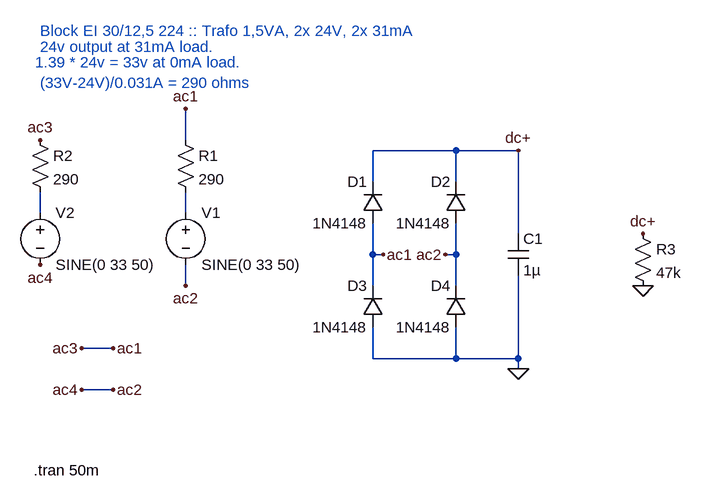
[diagram p0: schematic powersupply_ltspice_simulation.asc]
powersupply_ltspice_simulation.asc, the LTspice schematic file:
Version 4
SHEET 1 932 680
WIRE 160 96 160 48
WIRE 576 112 448 112
WIRE 672 112 576 112
WIRE 448 160 448 112
WIRE 576 160 576 112
WIRE -64 208 -64 176
WIRE 160 208 160 176
WIRE 672 240 672 112
WIRE 448 272 448 224
WIRE 464 272 448 272
WIRE 576 272 576 224
WIRE 576 272 560 272
WIRE 160 320 160 288
WIRE 448 320 448 272
WIRE 576 320 576 272
WIRE 48 416 0 416
WIRE 448 432 448 384
WIRE 576 432 576 384
WIRE 576 432 448 432
WIRE 672 432 672 304
WIRE 672 432 576 432
WIRE 672 448 672 432
WIRE 48 480 0 480
FLAG 160 48 ac1
FLAG -64 288 ac4
FLAG 160 320 ac2
FLAG 464 272 ac1
FLAG 560 272 ac2
FLAG 672 448 0
FLAG 672 112 dc+
FLAG 864 240 dc+
FLAG 864 320 0
FLAG -64 96 ac3
FLAG 0 416 ac3
FLAG 48 416 ac1
FLAG 0 480 ac4
FLAG 48 480 ac2
SYMBOL voltage 160 192 R0
WINDOW 123 0 0 Left 2
WINDOW 39 0 0 Left 2
SYMATTR InstName V1
SYMATTR Value SINE(0 33 50)
SYMBOL res 144 80 R0
SYMATTR InstName R1
SYMATTR Value 290
SYMBOL voltage -64 192 R0
WINDOW 123 0 0 Left 2
WINDOW 39 0 0 Left 2
SYMATTR InstName V2
SYMATTR Value SINE(0 33 50)
SYMBOL res -80 80 R0
SYMATTR InstName R2
SYMATTR Value 290
SYMBOL diode 464 224 R180
WINDOW 0 24 64 Left 2
WINDOW 3 24 0 Left 2
SYMATTR InstName D1
SYMATTR Value 1N4148
SYMBOL diode 592 224 R180
WINDOW 0 24 64 Left 2
WINDOW 3 24 0 Left 2
SYMATTR InstName D2
SYMATTR Value 1N4148
SYMBOL diode 464 384 R180
WINDOW 0 24 64 Left 2
WINDOW 3 24 0 Left 2
SYMATTR InstName D3
SYMATTR Value 1N4148
SYMBOL diode 592 384 R180
WINDOW 0 24 64 Left 2
WINDOW 3 24 0 Left 2
SYMATTR InstName D4
SYMATTR Value 1N4148
SYMBOL cap 656 240 R0
SYMATTR InstName C1
SYMATTR Value 1µ
SYMBOL res 848 224 R0
SYMATTR InstName R3
SYMATTR Value 47k
TEXT -64 -48 Left 2 ;24v output at 31mA load.
TEXT -72 -24 Left 2 ;1.39 * 24v = 33v at 0mA load.
TEXT -64 -72 Left 2 ;Block EI 30/12,5 224 :: Trafo 1,5VA, 2x 24V, 2x 31mA
TEXT -64 8 Left 2 ;(33V-24V)/0.031A = 290 ohms
TEXT -74 604 Left 2 !.tran 50m

The netlist it stands for:
* powersupply_ltspice_simulation.asc
V1 N002 ac2 SINE(0 33 50)
R1 ac3 N002 290
V2 N001 ac2 SINE(0 33 50)
R2 ac3 N001 290
D1 ac3 dc+ 1N4148
D2 ac2 dc+ 1N4148
D3 0 ac3 1N4148
D4 0 ac2 1N4148
C1 dc+ 0 1µ
R3 dc+ 0 47k
.model D D
.lib standard.dio
* 24v output at 31mA load.
* 1.39 * 24v = 33v at 0mA load.
* Block EI 30/12,5 224 :: Trafo 1,5VA, 2x 24V, 2x 31mA
* (33V-24V)/0.031A = 290 ohms
.tran 50m
.backanno
.end